# Altium schematic sheet bob_encoder.SchDoc
size A4; SheetNumber: 8; SheetTotal: 8
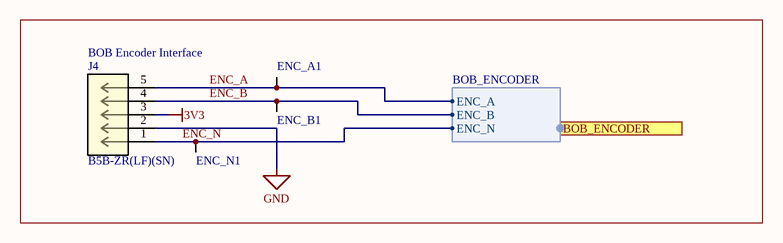
[diagram p0: bob_encoder.SchDoc]

## Parts
ENC_A1  Test Point (Via)  [TP]  (value not drawn)
ENC_B1  Test Point (Via)  [TP]  (value not drawn)
ENC_N1  Test Point (Via)  [TP]  (value not drawn)
J4  B5B-ZR(LF)(SN)  [JST_B5B-ZR(LF)(SN)]

## Blocks framed on the sheet
BOB Encoder Interface: ENC_A1 ENC_B1 ENC_N1 J4

## Ports
BOB_ENCODER (harness BOB_ENCODER)

## Harnesses
BOB_ENCODER: ENC_A, ENC_B, ENC_N

## Nets
3V3: J4.3
GND: J4.2
ENC_A: ENC_A1.1 J4.5 ; port BOB_ENCODER.ENC_A
ENC_B: ENC_B1.1 J4.4 ; port BOB_ENCODER.ENC_B
ENC_N: ENC_N1.1 J4.1 ; port BOB_ENCODER.ENC_N

## Library data of the parts
J4 = CN 5POS JST ZR: Connector Header Through Hole 5 position 0.059 (1.50mm); MF: JST Sales; Package: None; Check_prices: https://www.snapeda.com/parts/B5B-ZR(LF)(SN)/JST%20Sales%20America%20Inc./view-part/214617/?ref=eda; Purchase-URL: https://pricing.snapeda.com/search/part/B5B-ZR(LF)(SN)/?ref=eda; Price: None; MP: B5B-ZR(LF)(SN); Value: *; Availability: Warning; SnapEDA_Link: https://www.snapeda.com/parts/B5B-ZR(LF)(SN)/JST%20Sales%20America%20Inc./view-part/214617/?ref=snap; Supplier 1: Digi-Key; Supplier 2: Future Electronics; Supplier Part Number 1: 455-1660-ND; Supplier Part Number 2: 5800651